# Altium schematic sheet System.SchDoc
size A; SheetNumber: 1; SheetTotal: 12
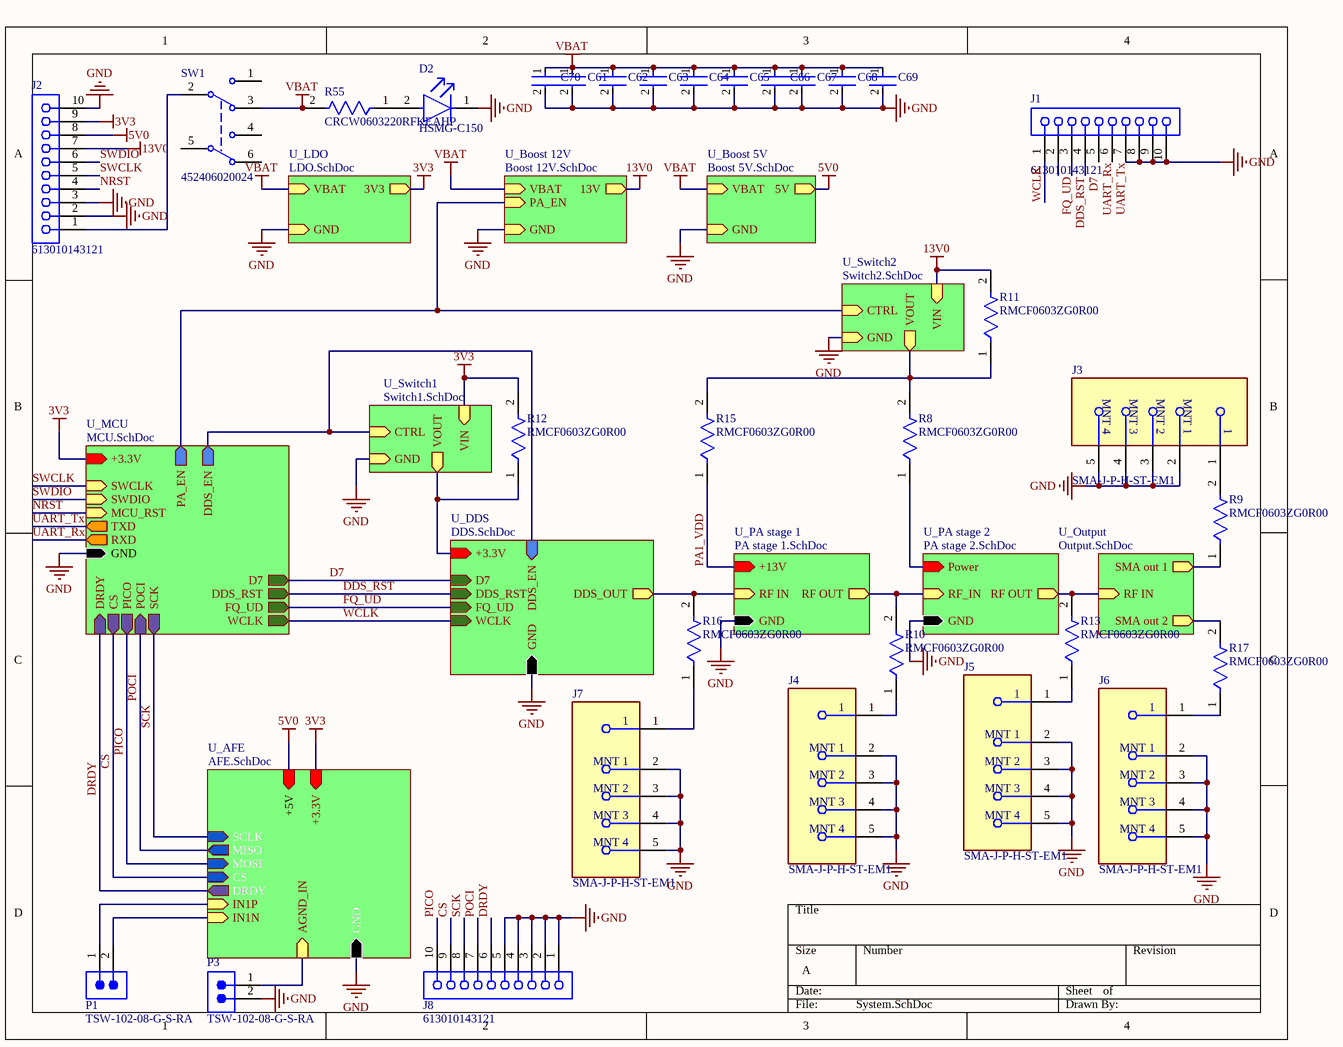
[diagram p0: System.SchDoc]

## Parts
C61  GRM21BR60J107ME15K  [FP-GRM21B-0_2-e0_2_0_7-IPC_B]  (value not drawn)
C62  GRM21BR60J107ME15K  [FP-GRM21B-0_2-e0_2_0_7-IPC_B]  (value not drawn)
C63  GRM21BR60J107ME15K  [FP-GRM21B-0_2-e0_2_0_7-IPC_B]  (value not drawn)
C64  GRM21BR60J107ME15K  [FP-GRM21B-0_2-e0_2_0_7-IPC_B]  (value not drawn)
C65  GRM21BR60J107ME15K  [FP-GRM21B-0_2-e0_2_0_7-IPC_B]  (value not drawn)
C66  GRM21BR60J107ME15K  [FP-GRM21B-0_2-e0_2_0_7-IPC_B]  (value not drawn)
C67  GRM21BR60J107ME15K  [FP-GRM21B-0_2-e0_2_0_7-IPC_B]  (value not drawn)
C68  GRM21BR60J107ME15K  [FP-GRM21B-0_2-e0_2_0_7-IPC_B]  (value not drawn)
C69  GRM21BR60J107ME15K  [FP-GRM21B-0_2-e0_2_0_7-IPC_B]  (value not drawn)
C70  GRM21BR60J107ME15K  [FP-GRM21B-0_2-e0_2_0_7-IPC_B]  (value not drawn)
D2  HSMG-C150  [FP-HSMG-C150-MFG]
J1  613010143121  [613010143121]
J2  613010143121  [613010143121]
J3  SMA-J-P-H-ST-EM1  [FP-SMA-J-P-H-ST-EM1-MFG]
J4  SMA-J-P-H-ST-EM1  [FP-SMA-J-P-H-ST-EM1-MFG]
J5  SMA-J-P-H-ST-EM1  [FP-SMA-J-P-H-ST-EM1-MFG]
J6  SMA-J-P-H-ST-EM1  [FP-SMA-J-P-H-ST-EM1-MFG]
J7  SMA-J-P-H-ST-EM1  [FP-SMA-J-P-H-ST-EM1-MFG]
J8  613010143121  [613010143121]
P1  TSW-102-08-G-S-RA  [SMTC-TSW-102-08-X-S-RA]
P3  TSW-102-08-G-S-RA  [SMTC-TSW-102-08-X-S-RA]
R8  RMCF0603ZG0R00  [FP-RMCF0603-IPC_B]
R9  RMCF0603ZG0R00  [FP-RMCF0603-IPC_B]
R10  RMCF0603ZG0R00  [FP-RMCF0603-IPC_B]
R11  RMCF0603ZG0R00  [FP-RMCF0603-IPC_B]
R12  RMCF0603ZG0R00  [FP-RMCF0603-IPC_B]
R13  RMCF0603ZG0R00  [FP-RMCF0603-IPC_B]
R15  RMCF0603ZG0R00  [FP-RMCF0603-IPC_B]
R16  RMCF0603ZG0R00  [FP-RMCF0603-IPC_B]
R17  RMCF0603ZG0R00  [FP-RMCF0603-IPC_B]
R55  CRCW0603220RFKEAHP  [FP-CRCW0603-HPe3-IPC_A]
SW1  452406020024  [452406020024]

## Sub-sheets
U_AFE = AFE.SchDoc: +5V (in), GND (in), +3.3V (in), DRDY (out), CS (in), SCLK (in), MISO (out), MOSI (in), IN1P (in), IN1N (in), AGND_IN (in)
U_Boost 5V = Boost 5V.SchDoc: VBAT (in), GND (in), 5V (out)
U_Boost 12V = Boost 12V.SchDoc: VBAT (in), GND (in), 13V (out), PA_EN (in)
U_DDS = DDS.SchDoc: DDS_OUT (out), D7 (in), DDS_RST (in), FQ_UD (in), WCLK (in), +3.3V (in), GND (in), DDS_EN (in)
U_LDO = LDO.SchDoc: VBAT (in), GND (in), 3V3 (out)
U_MCU = MCU.SchDoc: +3.3V (in), GND (in), SWCLK (in), SWDIO (in), MCU_RST (in), TXD (out), CS (out), PICO (out), POCI (in), SCK (out), D7 (out), DDS_RST (out), FQ_UD (out), WCLK (out), PA_EN (out), DDS_EN (out), DRDY (in), RXD (out)
U_Output = Output.SchDoc: RF IN (in), SMA out 1 (out), SMA out 2 (out)
U_PA stage 1 = PA stage 1.SchDoc: RF IN (in), RF OUT (out), GND (in), +13V (in)
U_PA stage 2 = PA stage 2.SchDoc: GND (in), RF OUT (out), Power (in), RF_IN (in)
U_Switch1 = Switch1.SchDoc: VIN (in), VOUT (out), CTRL (in), GND (in)
U_Switch2 = Switch2.SchDoc: VIN (in), VOUT (out), CTRL (in), GND (in)

## Nets
3V3: J2.9 R12.2 ; sheet U_MCU/+3.3V, sheet U_LDO/3V3, sheet U_Switch1/VIN, sheet U_AFE/+3.3V
5V0: J2.8 ; sheet U_Boost 5V/5V, sheet U_AFE/+5V
13V0: J2.7 R11.2 ; sheet U_Boost 12V/13V, sheet U_Switch2/VIN
GND: C61.2 C62.2 C63.2 C64.2 C65.2 C66.2 C67.2 C68.2 C69.2 C70.2 D2.1(C) J1.7 J1.8 J1.9 J1.10 J2.2 J2.3 J2.10 J3.2(MNT_1) J3.3(MNT_2) J3.4(MNT_3) J3.5(MNT_4) J4.2(MNT_1) J4.3(MNT_2) J4.4(MNT_3) J4.5(MNT_4) J5.2(MNT_1) J5.3(MNT_2) J5.4(MNT_3) J5.5(MNT_4) J6.2(MNT_1) J6.3(MNT_2) J6.4(MNT_3) J6.5(MNT_4) J7.2(MNT_1) J7.3(MNT_2) J7.4(MNT_3) J7.5(MNT_4) J8.1 J8.2 J8.3 J8.4 J8.5 P3.2 ; sheet U_MCU/GND, sheet U_DDS/GND, sheet U_PA stage 1/GND, sheet U_PA stage 2/GND, sheet U_LDO/GND, sheet U_Boost 12V/GND, sheet U_Switch1/GND, sheet U_Switch2/GND, sheet U_Boost 5V/GND, sheet U_AFE/GND
VBAT: C61.1 C62.1 C63.1 C64.1 C65.1 C66.1 C67.1 C68.1 C69.1 C70.1 R55.2 SW1.3 ; sheet U_LDO/VBAT, sheet U_Boost 12V/VBAT, sheet U_Boost 5V/VBAT
CS: J8.9 ; sheet U_MCU/CS, sheet U_AFE/CS
D7: J1.4 ; sheet U_MCU/D7, sheet U_DDS/D7
DDS_RST: J1.3 ; sheet U_MCU/DDS_RST, sheet U_DDS/DDS_RST
DRDY: J8.6 ; sheet U_MCU/DRDY, sheet U_AFE/DRDY
FQ_UD: J1.2 ; sheet U_MCU/FQ_UD, sheet U_DDS/FQ_UD
NRST: J2.4 ; sheet U_MCU/MCU_RST
PA1_VDD: R15.1 ; sheet U_PA stage 1/+13V
PICO: J8.10 ; sheet U_MCU/PICO, sheet U_AFE/MOSI
POCI: J8.7 ; sheet U_MCU/POCI, sheet U_AFE/MISO
SCK: J8.8 ; sheet U_MCU/SCK, sheet U_AFE/SCLK
SWCLK: J2.5 ; sheet U_MCU/SWCLK
SWDIO: J2.6 ; sheet U_MCU/SWDIO
UART_Rx: J1.5 ; sheet U_MCU/RXD
UART_Tx: J1.6 ; sheet U_MCU/TXD
WCLK: J1.1 ; sheet U_MCU/WCLK, sheet U_DDS/WCLK
NetD2_2: D2.2(A) R55.1
NetJ2_1: J2.1 SW1.2(COM)
NetJ3_1: J3.1 R9.2
NetJ4_1: J4.1 R10.1
NetJ5_1: J5.1 R13.1
NetJ6_1: J6.1 R17.1
NetJ7_1: J7.1 R16.1
NetP1_1: P1.1 ; sheet U_AFE/IN1P
NetP1_2: P1.2 ; sheet U_AFE/IN1N
NetP3_1: P3.1 ; sheet U_AFE/AGND_IN
NetR8_1: R8.1 ; sheet U_PA stage 2/Power
NetR8_2: R8.2 R11.1 R15.2 ; sheet U_Switch2/VOUT
NetR9_1: R9.1 ; sheet U_Output/SMA out 1
NetR10_2: R10.2 ; sheet U_PA stage 1/RF OUT, sheet U_PA stage 2/RF_IN
NetR12_1: R12.1 ; sheet U_DDS/+3.3V, sheet U_Switch1/VOUT
NetR13_2: R13.2 ; sheet U_PA stage 2/RF OUT, sheet U_Output/RF IN
NetR16_2: R16.2 ; sheet U_DDS/DDS_OUT, sheet U_PA stage 1/RF IN
NetR17_2: R17.2 ; sheet U_Output/SMA out 2
(unnamed): sheet U_MCU/PA_EN, sheet U_Boost 12V/PA_EN, sheet U_Switch2/CTRL
(unnamed): sheet U_MCU/DDS_EN, sheet U_DDS/DDS_EN, sheet U_Switch1/CTRL

Not connected (* = marked no-connect by the designer): SW1 1 4 5(COM) 6

## Library data of the parts
C61-C70 = CMP-06035-052658-1: Chip Multilayer Ceramic Capacitors for General Purpose, 0805, 100uF, X5R, 15%, 20%, 6.3V; Voltage Rating (DC): 6.3V; Lead Free: Lead Free; Length: 2mm; Tolerance: 20%; Width: 1.25mm; Capacitance: 100uF; Dielectric: X5R; Thickness: 1.25mm
D2 = CMP-2000-05061-2: LED GREEN DIFFUSED 1206 SMD; Manufacturer: Broadcom; Led Orientation: Top View; Max Junction Temp: +95°C; Peak Emmision Wavelength: 570nm; Viewing Angle: 170°; Wavelength: 572nm; Reverse Voltage: 5V; Luminous Intensity: 15mcd; Forward Voltage: 2.2V; Power Dissipation: 65mW; Forward Current: 20mA; ComponentLink2Description: Datasheet; Lead Free: Yes; Temperature Range Low: -40°C; Package: HSMG-C150; Digikey Description: LED GREEN DIFFUSED 1206 SMD; Mouser Description: LED Uni-Color Green 570nm 2-Pin Chip LED T/R; Manufacturer Part Number: HSMG-C150; Temperature Range High: +85°C; Device Class L1: Optoelectronics; Colour: Green; Category: Diode; Device Class L3: unset; RoHS: TRUE; Height: 1.2mm; ComponentLink2URL: https://docs.broadcom.com/docs/AV02-0551EN; Device Class L2: LEDs; Automotive: No; Ipc Land Pattern Name: DIOCP320160X55; Octopart: https://octopart.com/hsmg-c150-broadcom-71131304; Temperature: -40°C to +85°C
J1 J2 J8 = CMP-1502-01419-3: NexarPartId: 18818161; Operating Supply Voltage: 250V; Contact Resistance: 20mΩ; Gender: Female; Insulation Resistance: 1GΩ; Connector Type: Header, Socket; Insulation: Insulated; Current Rating: 3A; Number of Positions: 10; Pitch: 2.54mm; Number of Rows: 1; Number of Pins: 10; Voltage Rating: 250V; Length: 25.9mm; Contact Gender: Female; RoHS: Compliant; Contact Plating: Gold; Height: 8.5mm; Min Operating Temperature: -40°C; Contact Material: Copper; Number of Contacts: 10; REACH SVHC: Unknown; Mount: Through Hole; Lead Pitch: 2.54mm; Width: 25.9mm; Max Operating Temperature: 125°C; Flammability Rating: UL94 V-0; Termination: Through Hole; Color: Black; Housing Material: PBT
J3-J7 = CMP-02754-000006-1: CONN SMA JACK STR 50OHM EDGE MNT; Dielectric Material: PTFE; Center Contact Plating: Gold; Max Frequency: 6GHz; Body Material: Brass; Voltage Rating: 335V; Impedance: 50R; Package Quantity: 1; Case/Package: SMA; Max Operating Temperature: 125°C; Fastening Type: Threaded; Orientation: Straight; Depth: 13.33mm; RoHS Compliant: Yes; Length: 6.35mm; Insulation Material: Polytetrafluoroethylene; Termination: Solder; Min Operating Temperature: -65°C; Housing Color: Gold; Contact Plating: Gold; Contact Material: Copper; Connector Type: SMA; Mount: Edge; Series: SMA; Packaging: Tray; Body Plating: Gold; Radiation Hardening: No
P1 P3 = CMP-1024-00320-1: 0.025" SQ Post Header, Through-hole, Right Angle, -55 to 125 degC, 2.54 mm Pitch, 2-Pin, Male, RoHS; Manufacturer: Samtec; Pitch: 2.54 mm; Temperature Range: -55 to 125 degC; PackageDescription: .025[0.64] SQ. Post Terminal Strip Assembly; ComponentLink3Description: Package Specification; ComponentLink2Description: Datasheet; PackageReference: TSW-102-08-X-S-RA; ComponentLink1Description: Manufacturer URL; ComponentLink2URL: http://www.samtec.com/documents/webfiles/pdf/TSW_TH.PDF; PackageVersion: DM, 8/1988; RoHS: True; PartNumber: TSW-102-08-G-S-RA; Mounting Technology: Through-hole; Orientation: Right Angle; ComponentLink1URL: http://www.samtec.com; DatasheetVersion: F-214; ComponentLink3URL: http://www.samtec.com/documents/webfiles/cpdf/TSW-XXX-XX-XXX-X-XX-XXX-MKT.pdf
R8-R13 R15-R17 = CMP-26527-006412-1: 0Ω ±0 0.1W 0603 Thick Film Chip Resistor AEC-Q200 compliant; Max Power Dissipation: 100mW; Resistance: 0R; Width: 0.031inch; RoHS Compliant: Yes; Number of Terminations: 2; Case/Package: 0603; Contact Plating: Tin; Height: 0.022inch; Resistor Type: Thick Film; Mount: Surface Mount; Length: 0.061inch; Features: Automotive AEC-Q200; Series: RMCF; Max Operating Temperature: 155°C; Radiation Hardening: No; Min Operating Temperature: -55°C; Packaging: Tape and Reel
R55 = CMP-02407-003593-1: RES Thick Film, 220Ω, 1%, 0.33W, 100ppm/°C, 0603; Max Power Dissipation: 250mW; Voltage Rating (DC): 75V; Resistance: 220R; Radiation Hardening: No; Contact Plating: Tin; Length: 1.6mm; Depth: 0.85mm; Composition: Thick Film; Lead Free: Lead Free; Mount: Surface Mount; Package Quantity: 5000; Height: 0.45mm; Termination: SMD/SMT; Weight: 7.1E-05oz; Military Standard: Not; Number of Terminations: 2; Case Code (Metric): 1608; Max Operating Temperature: 155°C; Power Rating: 250mW; Tolerance: 1%; Temperature Coefficient: 100ppm/°C; Features: Automotive AEC-Q200; Case Code (Imperial): 0603; Width: 0.033inch; Min Operating Temperature: -55°C; Case/Package: 0603; Voltage Rating: 75V; Packaging: Tape and Reel
SW1 = CMP-03913-146831046-1: Ws-slsv_smt Mini Slide Switch Sa